# Altium schematic sheet AFE.SchDoc: Analog Frontend
size A3; ApprovedBy: Robin Geißler; CheckedBy: Robin Geißler; Author: Robin Geißler; CompanyName: Fraunhofer EMFT; DrawnBy: Robin Geißler; Engineer: Robin Geißler; Revision: 1.1.; SheetNumber: 4; SheetTotal: 6
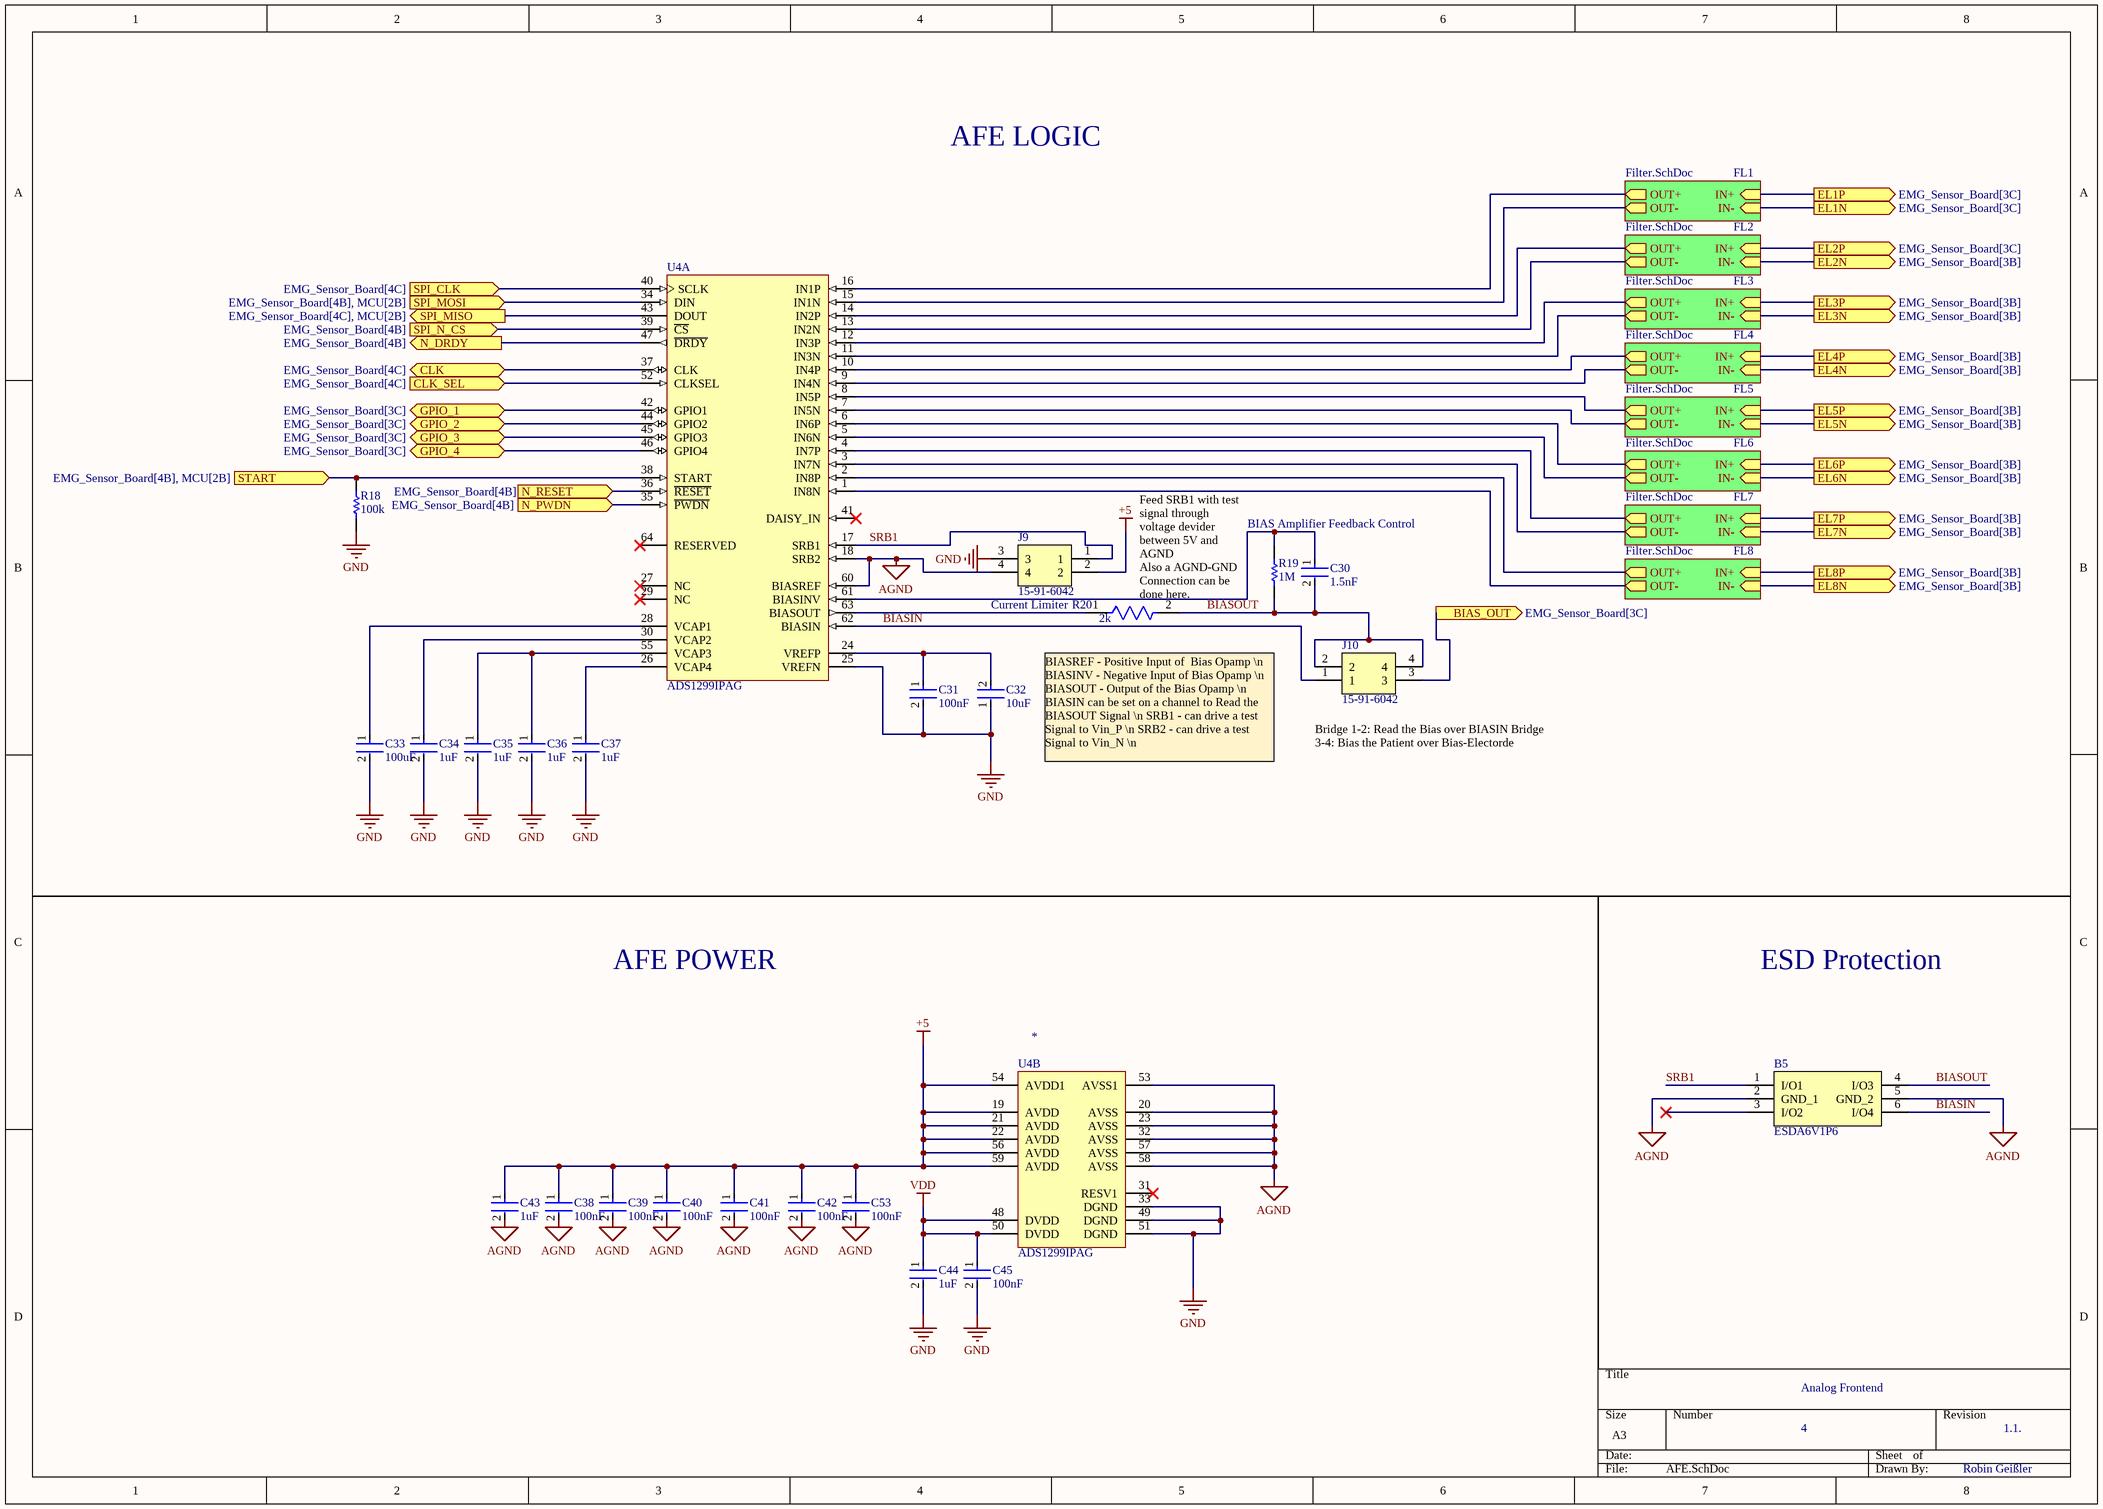
[diagram p0: AFE.SchDoc]

## Parts
B5  ESDA6V1P6  [ESDA6V1P6]
C30  1.5nF  [FP-GRM188-0_1-e0_2_0_5-IPC_B]
C31  100nF  [FP-CGA3E-0_3-0_1-IPC_A]
C32  10uF  [FP-C1608-080-0_1-MFG]
C33  100uF  [FP-C4532-280-0_4-IPC_B]
C34  1uF  [FP-CGA3E-0_3-0_1-IPC_B]
C35  1uF  [FP-CGA3E-0_3-0_1-IPC_B]
C36  1uF  [FP-CGA3E-0_3-0_1-IPC_B]
C37  1uF  [FP-CGA3E-0_3-0_1-IPC_B]
C38  100nF  [FP-CGA3E-0_3-0_1-IPC_A]
C39  100nF  [FP-CGA3E-0_3-0_1-IPC_A]
C40  100nF  [FP-CGA3E-0_3-0_1-IPC_A]
C41  100nF  [FP-CGA3E-0_3-0_1-IPC_A]
C42  100nF  [FP-CGA3E-0_3-0_1-IPC_A]
C43  1uF  [FP-CGA3E-0_3-0_1-IPC_B]
C44  1uF  [FP-CGA3E-0_3-0_1-IPC_B]
C45  100nF  [FP-CGA3E-0_3-0_1-IPC_A]
C53  100nF  [FP-CGA3E-0_3-0_1-IPC_A]
J9  15-91-6042  [15916042]
J10  15-91-6042  [15916042]
R18  100k  [RESC1609X55X30ML10T20]
R19  1M  [RESC1608X55X25LL10T15]
R20  2k  [FP-ERA3A-IPC_C]
U4  ADS1299IPAG  [PAG0064A_N]  (parts A,B of 2)

## Sub-sheets
FL1 = Filter.SchDoc: IN+ (in), IN- (in), OUT+ (out), OUT- (out)
FL2 = Filter.SchDoc: IN+ (in), IN- (in), OUT+ (out), OUT- (out)
FL3 = Filter.SchDoc: IN+ (in), IN- (in), OUT+ (out), OUT- (out)
FL4 = Filter.SchDoc: IN+ (in), IN- (in), OUT+ (out), OUT- (out)
FL5 = Filter.SchDoc: IN+ (in), IN- (in), OUT+ (out), OUT- (out)
FL6 = Filter.SchDoc: IN+ (in), IN- (in), OUT+ (out), OUT- (out)
FL7 = Filter.SchDoc: IN+ (in), IN- (in), OUT+ (out), OUT- (out)
FL8 = Filter.SchDoc: IN+ (in), IN- (in), OUT+ (out), OUT- (out)

## Ports
BIAS_OUT (out, see EMG_Sensor_Board[3C]), CLK (bidir, see EMG_Sensor_Board[4C]), CLK_SEL (in, see EMG_Sensor_Board[4C]), EL1N (out, see EMG_Sensor_Board[3C]), EL1P (out, see EMG_Sensor_Board[3C]), EL2N (out, see EMG_Sensor_Board[3B]), EL2P (out, see EMG_Sensor_Board[3C]), EL3N (out, see EMG_Sensor_Board[3B]), EL3P (out, see EMG_Sensor_Board[3B]), EL4N (out, see EMG_Sensor_Board[3B]), EL4P (out, see EMG_Sensor_Board[3B]), EL5N (out, see EMG_Sensor_Board[3B]), EL5P (out, see EMG_Sensor_Board[3B]), EL6N (out, see EMG_Sensor_Board[3B]), EL6P (out, see EMG_Sensor_Board[3B]), EL7N (out, see EMG_Sensor_Board[3B]), EL7P (out, see EMG_Sensor_Board[3B]), EL8N (out, see EMG_Sensor_Board[3B]), EL8P (out, see EMG_Sensor_Board[3B]), GPIO_1 (bidir, see EMG_Sensor_Board[3C]), GPIO_2 (bidir, see EMG_Sensor_Board[3C]), GPIO_3 (bidir, see EMG_Sensor_Board[3C]), GPIO_4 (bidir, see EMG_Sensor_Board[3C]), N_DRDY (out, see EMG_Sensor_Board[4B]), N_PWDN (in, see EMG_Sensor_Board[4B]), N_RESET (in, see EMG_Sensor_Board[4B]), SPI_CLK (in, see EMG_Sensor_Board[4C]), SPI_MISO (out, see EMG_Sensor_Board[4C], MCU[2B]), SPI_MOSI (in, see EMG_Sensor_Board[4B], MCU[2B]), SPI_N_CS (in, see EMG_Sensor_Board[4B]), START (in, see EMG_Sensor_Board[4B], MCU[2B])

## Nets
+5: C38.1 C39.1 C40.1 C41.1 C42.1 C43.1 C53.1 J9.2 U4.19(AVDD) U4.21(AVDD) U4.22(AVDD) U4.54(AVDD1) U4.56(AVDD) U4.59(AVDD)
AGND: B5.2(GND_1) B5.5(GND_2) C38.2 C39.2 C40.2 C41.2 C42.2 C43.2 C53.2 J9.4 U4.18(SRB2) U4.20(AVSS) U4.23(AVSS) U4.32(AVSS) U4.53(AVSS1) U4.57(AVSS) U4.58(AVSS) U4.60(BIASREF)
GND: C31.2 C32.1 C33.2 C34.2 C35.2 C36.2 C37.2 C44.2 C45.2 J9.3 R18.1 U4.25(VREFN) U4.33(DGND) U4.49(DGND) U4.51(DGND)
VDD: C44.1 C45.1 U4.48(DVDD) U4.50(DVDD)
BIAS_OUT: J10.3 ; port BIAS_OUT
BIASIN: B5.6(I/O4) J10.1 U4.62(BIASIN)
BIASOUT: B5.4(I/O3) C30.2 J10.2 J10.4 R19.1 R20.2
CLK: U4.37(CLK) ; port CLK
CLK_SEL: U4.52(CLKSEL) ; port CLK_SEL
EL1N: port EL1N, sheet FL1/IN-
EL1P: port EL1P, sheet FL1/IN+
EL2N: port EL2N, sheet FL2/IN-
EL2P: port EL2P, sheet FL2/IN+
EL3N: port EL3N, sheet FL3/IN-
EL3P: port EL3P, sheet FL3/IN+
EL4N: port EL4N, sheet FL4/IN-
EL4P: port EL4P, sheet FL4/IN+
EL5N: port EL5N, sheet FL5/IN-
EL5P: port EL5P, sheet FL5/IN+
EL6N: port EL6N, sheet FL6/IN-
EL6P: port EL6P, sheet FL6/IN+
EL7N: port EL7N, sheet FL7/IN-
EL7P: port EL7P, sheet FL7/IN+
EL8N: port EL8N, sheet FL8/IN-
EL8P: port EL8P, sheet FL8/IN+
GPIO_1: U4.42(GPIO1) ; port GPIO_1
GPIO_2: U4.44(GPIO2) ; port GPIO_2
GPIO_3: U4.45(GPIO3) ; port GPIO_3
GPIO_4: U4.46(GPIO4) ; port GPIO_4
N_DRDY: U4.47(~{DRDY}) ; port N_DRDY
N_PWDN: U4.35(~{PWDN}) ; port N_PWDN
N_RESET: U4.36(~{RESET}) ; port N_RESET
SPI_CLK: U4.40(SCLK) ; port SPI_CLK
SPI_MISO: U4.43(DOUT) ; port SPI_MISO
SPI_MOSI: U4.34(DIN) ; port SPI_MOSI
SPI_N_CS: U4.39(~{CS}) ; port SPI_N_CS
SRB1: B5.1(I/O1) J9.1 U4.17(SRB1)
START: R18.2 U4.38(START) ; port START
NetC30_1: C30.1 R19.2 U4.61(BIASINV)
NetC31_1: C31.1 C32.2 U4.24(VREFP)
NetC33_1: C33.1 U4.28(VCAP1)
NetC34_1: C34.1 U4.30(VCAP2)
NetC35_1: C35.1 C36.1 U4.55(VCAP3)
NetC37_1: C37.1 U4.26(VCAP4)
NetR20_1: R20.1 U4.63(BIASOUT)
NetU4_1: U4.1(IN8N) ; sheet FL8/OUT-
NetU4_2: U4.2(IN8P) ; sheet FL8/OUT+
NetU4_3: U4.3(IN7N) ; sheet FL7/OUT-
NetU4_4: U4.4(IN7P) ; sheet FL7/OUT+
NetU4_5: U4.5(IN6N) ; sheet FL6/OUT-
NetU4_6: U4.6(IN6P) ; sheet FL6/OUT+
NetU4_7: U4.7(IN5N) ; sheet FL5/OUT-
NetU4_8: U4.8(IN5P) ; sheet FL5/OUT+
NetU4_9: U4.9(IN4N) ; sheet FL4/OUT-
NetU4_10: U4.10(IN4P) ; sheet FL4/OUT+
NetU4_11: U4.11(IN3N) ; sheet FL3/OUT-
NetU4_12: U4.12(IN3P) ; sheet FL3/OUT+
NetU4_13: U4.13(IN2N) ; sheet FL2/OUT-
NetU4_14: U4.14(IN2P) ; sheet FL2/OUT+
NetU4_15: U4.15(IN1N) ; sheet FL1/OUT-
NetU4_16: U4.16(IN1P) ; sheet FL1/OUT+

Not connected (* = marked no-connect by the designer): B5 3(I/O2)*; U4 27(NC)* 29(NC)* 31(RESV1)* 41(DAISY_IN)* 64(RESERVED)*

## Notes on the sheet
- AFE LOGIC
- BIAS Amplifier Feedback Control
- Current Limiter
- (near R20) Feed SRB1 with test signal through voltage devider between 5V and AGND
  Also a AGND-GND Connection can be done here.
- BIASREF - Positive Input of  Bias Opamp \n BIASINV - Negative Input of Bias Opamp \n BIASOUT - Output of the Bias Opamp \n BIASIN can be set on a channel to Read the BIASOUT Signal \n SRB1 - can drive a test Signal to Vin_P \n SRB2 - can drive a test Signal to Vin_N \n
- (near J10) Bridge 1-2: Read the Bias over BIASIN Bridge 3-4: Bias the Patient over Bias-Electorde
- AFE POWER
- ESD Protection

## Library data of the parts
B5 = ESDA6V1P6: 4 line ESD protection, 6.1 V VBR, in SOT666; Manufacturer_Name: STMicroelectronics; Geometry.Height: 0.62mm; Manufacturer_Part_Number: ESDA6V1P6; Mouser Part Number: 511-ESDA6V1P6; Mouser Price/Stock: https://www.mouser.co.uk/ProductDetail/STMicroelectronics/ESDA6V1P6?qs=ewe0KQ%2FSs5H0%252BSAub%2FR2ag%3D%3D; Arrow Part Number: ESDA6V1P6; Arrow Price/Stock: https://www.arrow.com/en/products/esda6v1p6/stmicroelectronics?region=nac; Datasheet Link: https://www.st.com/resource/en/datasheet/esda14v2bp6.pdf; Supplier 1: Mouser; Supplier Part Number 1: 511-ESDA6V1P6
C30 = CMP-06035-043535-1: Chip Multilayer Ceramic Capacitors for General Purpose, 0603, 1500pF, C0G, 30ppm/°C, 5%, 50V; Insulation Resistance: 10GR; Lead Free: Lead Free; REACH SVHC: No SVHC; Dielectric: C0G; Package Quantity: 1; Case/Package: 0603; Material: Ceramic; Height: 0.8mm; Length: 1.6mm; Max Operating Temperature: 125°C; Thickness: 0.035inch; Mount: Surface Mount; Depth: 0.8mm; Case Code (Metric): 1608; Dielectric Material: Ceramic; Radiation Hardening: No; Capacitance: 1.5nF; Termination: SMD/SMT; Tolerance: 5%; Number of Pins: 2; Temperature Coefficient: 30ppm/°C; Packaging: Tape and Reel; Width: 0.8mm; Voltage: 50V; Case Code (Imperial): 0603; Voltage Rating: 50V; Voltage Rating (DC): 50V; Min Operating Temperature: -55°C
C31 C38-C42 C45 C53 = CMP-2000-07546-2: Cap Ceramic 100nF 50V X7R 10% Pad SMD 0603 +125°C Automotive T/R; Weight: 7.1E-05oz; Composition: Ceramic; Max Operating Temperature: 125°C; Termination: SMD/SMT; Dielectric: X7R; Length: 1.6mm; Package Quantity: 1; REACH SVHC: No SVHC; Lead Free: Lead Free; Case Code (Metric): 1608; Min Operating Temperature: -55°C; Packaging: Tape and Reel; Tolerance: 10%; Voltage Rating: 50V; Case Code (Imperial): 0603; Capacitance: 100nF; Case/Package: 0603; Voltage Rating (DC): 50V; Depth: 0.8mm; Radiation Hardening: No; Ratings: AEC-Q200; Mount: Surface Mount; Voltage: 50V; Thickness: 0.035inch; Width: 0.8mm; Height: 0.8mm
C32 = CMP-2000-04979-3: Multilayer Ceramic Capacitors 10μF ±10% 10V X5R SMD 0603; Dielectric Material: Ceramic; Construction: Flat; Height: 0.8mm; Thickness: 0.035inch; Case Code (Metric): 1608; Radiation Hardening: No; Number of Pins: 2; Voltage Rating (DC): 10V; Depth: 0.8mm; Voltage: 10V; RoHS Compliant: Yes; Voltage Rating: 10V; Package Quantity: 1; Resistor Type: Ceramic; Termination: SMD/SMT; Lead Free: Lead Free; REACH SVHC: No SVHC; Tolerance: 10%; Mount: Surface Mount; Series: C; Packaging: Tape and Reel; Width: 0.8mm; Dielectric: X5R; Weight: 7.1E-05oz; Length: 1.6mm; Max Operating Temperature: 85°C; Case Code (Imperial): 0603; Case/Package: 0603; Min Operating Temperature: -55°C; Capacitance: 10uF
C33 = CMP-08246-002633-1: CAP CER 100UF 6.3V X6S 1812; Tolerance: 20%; Dielectric Material: Ceramic; Min Operating Temperature: -55°C; Package Quantity: 500; Voltage Rating (DC): 6.3V; Width: 0.126inch; Packaging: Tape and Reel; Series: C; Case Code (Metric): 4532; Lead Free: Lead Free; Mount: Surface Mount; Case Code (Imperial): 1812; Max Operating Temperature: 105°C; Capacitance: 100uF; Length: 0.177inch; Case/Package: 1812; Voltage Rating: 6.3V; Thickness: 0.122inch; RoHS Compliant: Yes
C34-C37 C43 C44 = CMP-08246-002551-1: Cap Ceramic 1uF 35V X7R 10% Pad SMD 0603 +125°C Automotive T/R; Termination: SMD/SMT; Packaging: Tape and Reel; Capacitance: 1uF; Tolerance: 10%; Mount: Surface Mount; Thickness: 0.035inch; Case Code (Imperial): 0603; Voltage Rating: 35V; Case/Package: 0603; Case Code (Metric): 1608; Dielectric: X7R; Width: 0.031inch; Length: 0.063inch; Min Operating Temperature: -55°C; Weight: 7.1E-05oz; Max Operating Temperature: 125°C; Voltage Rating (DC): 35V; Height: 0.8mm; Ratings: AEC-Q200; Package Quantity: 4000
J9 J10 = 15-91-6042: 2.54mm Pitch SL Wire-to-Board Header, Low Profile, Surface Mount, Single Row, Right-Angle, 3.05mm Pocket, Shrouded, with Press-fit Plastic Peg,  Circuits, Tin (Sn) Plating, Embossed Tape Packaging; Manufacturer_Name: Molex; Geometry.Height: 11.69mm; Manufacturer_Part_Number: 15-91-6042; Mouser Part Number: 538-15-91-6042; Mouser Price/Stock: https://www.mouser.co.uk/ProductDetail/Molex/15-91-6042?qs=3DzawVMofg8HeBuyct9LCA%3D%3D; Arrow Part Number: *; Arrow Price/Stock: *; Datasheet Link: https://componentsearchengine.com/Datasheets/1/15-91-6042.pdf
R18 = CMP-2000-03685-1: TNPW0603100KBEEA; Manufacturer: Vishay Dale; Part Number: TNPW0603100KBEEA
R19 = CMP-1659-00056-1: Chip Resistor, 1 MOhm, +/- 1%, 100 mW, -55 to 155 degC, 0603 (1608 Metric), RoHS, Tape and Reel; Voltage Rating (DC): 25 V; Tolerance: 20%; Case\Package: Radial; Capacitance: 1 mF; Min Operating Temperature: -40 degC; PackageDescription: 2-Pin Surface Mount Device, Body 1.6 x 0.8 mm; ComponentLink1Description: Manufacturer URL; Radiation Hardening: No; DatasheetVersion: Rev. 4, 02/2016; REACH SVHC: No SVHC; Length: 20 mm; Max Operating Temperature: 85 degC; Diameter: 10 mm; Packaging: Bulk; Package Quantity: 200; PackageReference: 0603; Mount: Through Hole; ComponentLink1URL: http://www.yageo.com/; ComponentLink2URL: http://www.yageo.com/documents/recent/PYu-RC_Group_51_RoHS_L_04.pdf; ComponentLink2Description: Datasheet; Width: 0 inch; Lead Pitch: 5 mm; RoHSCompliant: true; Voltage Rating: 25 V; Height: 20 mm
R20 = CMP-2000-00945-2: RES SMD 2K OHM 0.1% 1/10W 0603; Resistance: 2kR; Max Power Dissipation: 100mW; Voltage Rating (DC): 75V; Temperature Coefficient: 25ppm/°C; REACH SVHC: No SVHC; Number of Terminations: 2; RoHS Compliant: Yes; Case Code (Metric): 1608; Package Quantity: 5000; Width: 0.8mm; Mount: Surface Mount; Series: ERA-3A; Number of Pins: 2; Height: 0.45mm; Military Standard: Not; Packaging: Tape and Reel; Resistor Type: Thin Film; Lead Free: Lead Free; Construction: Rectangular; Max Operating Temperature: 155°C; Contact Plating: Tin; Termination: SMD/SMT; Technology: THIN FILM; Length: 1.6mm; Power Rating: 100mW; Resistance Tolerance: 0.1%; Working Voltage: 75V; Voltage Rating: 75V; Depth: 0.8mm; Case Code (Imperial): 0603; Radiation Hardening: No; Case/Package: 0603; Tolerance: 0.1%; Min Operating Temperature: -55°C
U4 = CMP-0841-00002-2: Low-Noise, 8-Channel, 24-Bit Analog Front-End for Biopotential Measurement, 16 KSPS, -40 to 85 degC, 64-Pin PQFP (PAG-64), RoHS, Tube; Manufacturer: Texas Instruments; Architecture: Delta-Sigma; Reference Mode: Int, Ext; # Input Channels: 8; Resolution (Bits): 24; Sample Rate (max) (KSPS): 16; Interface: Serial SPI; Packing: PAG0064A; PackageVersion: 4040282/C; PackageReference: PAG-64; ComponentLink3Description: Package Specification; DatasheetVersion: SBAS499A; ComponentLink1Description: Manufacturer URL; ComponentLink2Description: Datasheet; PackageDescription: 64-Pin Plastic Quad Flatpack, Body 10 x 10 mm, Pitch 0.5 mm; RoHS: TRUE; Operating Temperature Range (C): -40 to 85; ComponentLink3URL: http://www.ti.com/lit/ml/mtqf006a/mtqf006a.pdf; ComponentLink1URL: http://www.ti.com/; ComponentLink2URL: http://www.ti.com/lit/ds/symlink/ads1299.pdf; PartNumber: ADS1299IPAG; Mounting Technology: Surface Mount